# EAGLE design armwiz-board (EAGLE 6.5.0)
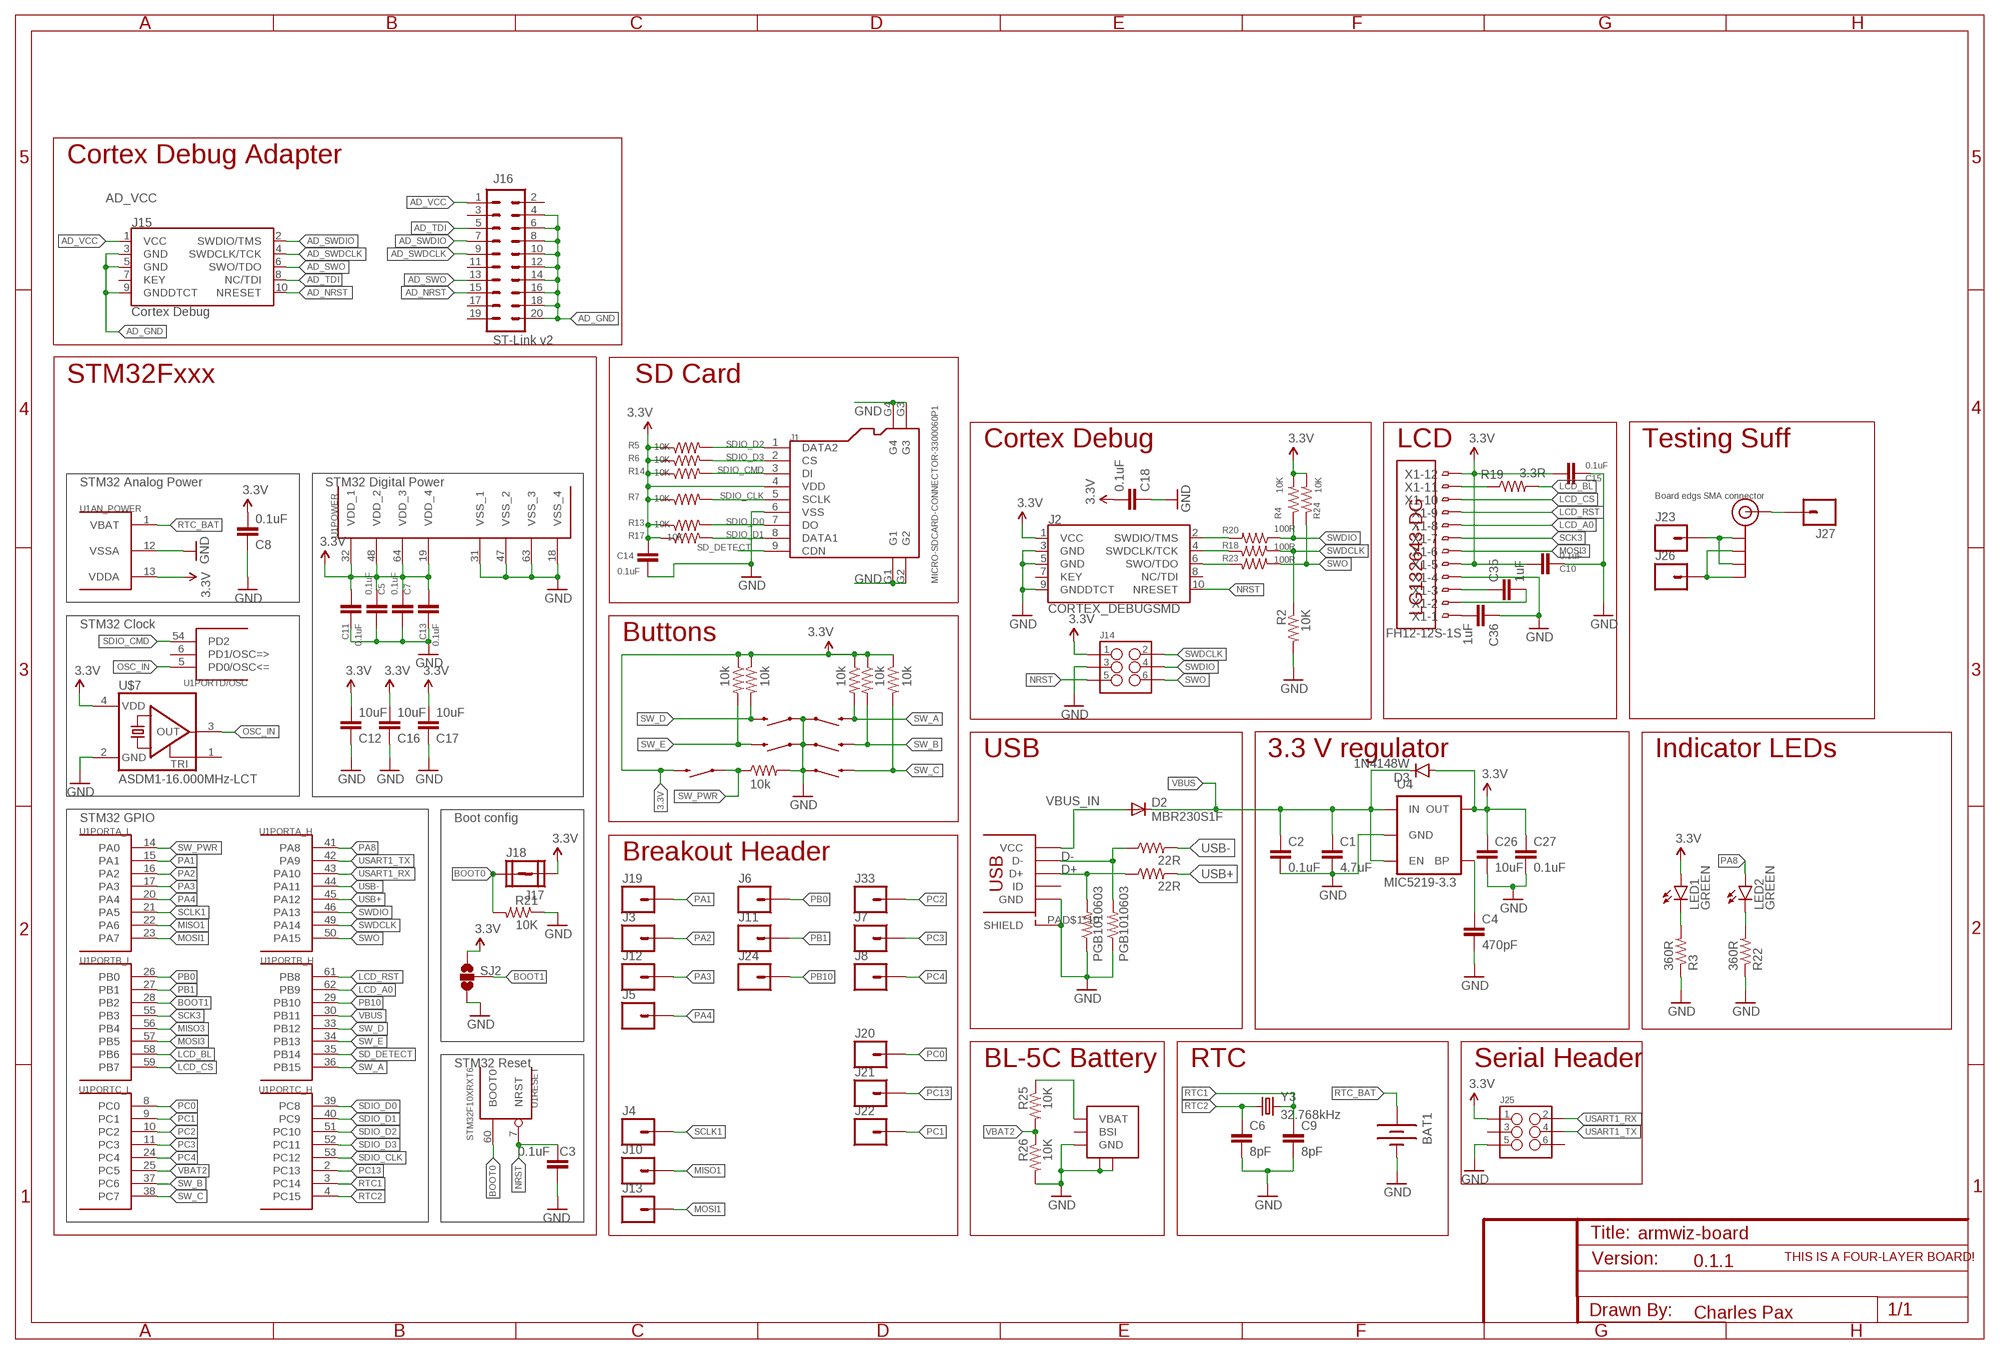
[diagram p0: schematic, sheet 1]

## Parts
BAT1  BATTERY12MM  [BATTCON_12MM]
C1  4.7uF  C-EUC0402K  [C0402K]
C2  0.1uF  C-EUC0402K  [C0402K]
C3  0.1uF  C-EUC0402K  [C0402K]
C4  470pF  C-EUC0402K  [C0402K]
C5  0.1uF  C-EUC0402K  [C0402K]
C6  8pF  C-EUC0402K  [C0402K]
C7  0.1uF  C-EUC0402K  [C0402K]
C8  0.1uF  C-EUC0402K  [C0402K]
C9  8pF  C-EUC0402K  [C0402K]
C10  0.1uF  C-EUC0402K  [C0402K]
C11  0.1uF  C-EUC0402K  [C0402K]
C12  10uF  C-EUC0402K  [C0402K]
C13  0.1uF  C-EUC0402K  [C0402K]
C14  0.1uF  C-EUC0402K  [C0402K]
C15  0.1uF  C-EUC0402K  [C0402K]
C16  10uF  C-EUC0402K  [C0402K]
C17  10uF  C-EUC0402K  [C0402K]
C18  0.1uF  C-EUC0402K  [C0402K]
C26  10uF  C-EUC0402K  [C0402K]
C27  0.1uF  C-EUC0402K  [C0402K]
C35  1uF  C-EUC0402K  [C0402K]
C36  1uF  C-EUC0402K  [C0402K]
D2  MBR230S1F  SPARKFUN-DISCRETESEMI_DIODESOD123SOD123  [SOD123]
D3  1N4148W  DIODESOD123  [SOD-123]
J1  MICRO-SDCARD-CONNECTOR-3300060P1  [9P-SMD-W-RING]
J2  CORTEX_DEBUGSMD  [SAMTECH_FTSH-105-01]
J3  M01PTH  [1X01]
J4  M01PTH  [1X01]
J5  M01PTH  [1X01]
J6  M01PTH  [1X01]
J7  M01PTH  [1X01]
J8  M01PTH  [1X01]
J10  M01PTH  [1X01]
J11  M01PTH  [1X01]
J12  M01PTH  [1X01]
J13  M01PTH  [1X01]
J14  M03X2PAX  [CONNECTORS_2X3_SMT_POSTS_T400]
J15  Cortex Debug  CORTEX_DEBUGSMD  [SAMTECH_FTSH-105-01]
J16  ST-Link v2  M10X2  [2X10]
J17  M01NOSILK-KIT  [1X01NS-KIT]
J18  M01NOSILK-KIT  [1X01NS-KIT]
J19  M01PTH  [1X01]
J20  M01PTH  [1X01]
J21  M01PTH  [1X01]
J22  M01PTH  [1X01]
J23  M01PTH  [1X01]
J24  M01PTH  [1X01]
J25  M03X2PAX  [CONNECTORS_2X3_SMT_POSTS_T400]
J26  M01PTH  [1X01]
J27  M01PTH  [1X01]
J33  M01PTH  [1X01]
J$1  SMA_EDGE  [SMA-EDGE]
LED1  GREEN  LED0603  [LED-0603]
LED2  GREEN  LED0603  [LED-0603]
R1  10k  R-US_R0402  [R0402]
R2  10K  R-US_R0402  [R0402]
R3  360R  R-US_R0402  [R0402]
R4  10K  R-US_R0402  [R0402]
R5  10K  R-US_R0402  [R0402]
R6  10K  R-US_R0402  [R0402]
R7  10K  R-US_R0402  [R0402]
R8  10k  R-US_R0402  [R0402]
R9  22R  R-US_R0402  [R0402]
R10  22R  R-US_R0402  [R0402]
R11  10k  R-US_R0402  [R0402]
R12  10k  R-US_R0402  [R0402]
R13  10K  R-US_R0402  [R0402]
R14  10K  R-US_R0402  [R0402]
R15  10k  R-US_R0402  [R0402]
R16  10k  R-US_R0402  [R0402]
R17  10K  R-US_R0402  [R0402]
R18  100R  R-US_R0402  [R0402]
R19  3.3R  R-US_R0402  [R0402]
R20  100R  R-US_R0402  [R0402]
R21  10K  R-US_R0402  [R0402]
R22  360R  R-US_R0402  [R0402]
R23  100R  R-US_R0402  [R0402]
R24  10K  R-US_R0402  [R0402]
R25  10K  R-US_R0402  [R0402]
R26  10K  R-US_R0402  [R0402]
S1  SWITCH-MOMENTARY-2SMD  [TACTILE_SWITCH_SMD]
S2  SWITCH-MOMENTARY-2SMD  [TACTILE_SWITCH_SMD]
S3  SWITCH-MOMENTARY-2SMD  [TACTILE_SWITCH_SMD]
S4  SWITCH-MOMENTARY-2SMD  [TACTILE_SWITCH_SMD]
S5  SWITCH-MOMENTARY-2SMD  [TACTILE_SWITCH_SMD]
S6  SWITCH-MOMENTARY-2SMD  [TACTILE_SWITCH_SMD]
SJ2  SOLDERJUMPER_2WAYS  [SJ_3]
U1  STM32F10XRXT6  [TQFP64]
U4  MIC5219-3.3V  V_REG_LDOSMD  [SOT23-5]
U$1  USB_MICROSMT+THRUHULE  [USB_MICRO_THRUHOLE]
U$2  FOUR_LAYER_WARNING  [FOUR_LAYER_WARNING]
U$3  BL-5C-CONNECTOR  [BL-5C-CONNECTOR]
U$5  LG132643-DG  [LG132643-DG]
U$7  ASDM1-16.000MHz-LCT  ASE  [ASE]
X1  FH12-12S-1S  [FH12-12S-1SH]
Y3  32.768kHz  CRYSTAL3.2X1.5MM  [CRYSTAL-SMD-3.2X1.5MM]
Z1  PGB1010603  SPARKFUN-RESISTORS_RESISTOR0603-RES  [SPARKFUN-RESISTORS_0603-RES]
Z2  PGB1010603  SPARKFUN-RESISTORS_RESISTOR0603-RES  [SPARKFUN-RESISTORS_0603-RES]

## Nets
3.3V: C5.1 C7.1 C8.2 C10.2 C11.2 C12.2 C13.2 C14.2 C15.2 C16.2 C17.2 C18.2 C26.1 C27.1 D3.A J1.4(VDD) J2.1(VCC) J14.1 J18.1 J25.1 LED1.A R4.2 R5.1 R6.1 R7.1 R8.1 R11.1 R12.1 R13.1 R14.1 R15.1 R16.1 R17.1 R24.2 S6.3 SJ2.3 U1.13(AN_POWER:VDDA) U1.19(POWER:VDD_4) U1.32(POWER:VDD_1) U1.48(POWER:VDD_2) U1.64(POWER:VDD_3) U4.5(OUT) U$7.4(VDD) X1.5 X1.12
AD_GND: J15.3(GND) J15.5(GND) J15.9(GNDDTCT) J16.4 J16.6 J16.8 J16.10 J16.12 J16.14 J16.16 J16.18 J16.20
AD_NRST: J15.10(NRESET) J16.15
AD_SWDCLK: J15.4(SWDCLK/TCK) J16.9
AD_SWDIO: J15.2(SWDIO/TMS) J16.7
AD_SWO: J15.6(SWO/TDO) J16.13
AD_TDI: J15.8(NC/TDI) J16.5
AD_VCC: J15.1(VCC) J16.1
BOOT0: J17.1 R21.2 U1.60(RESET:BOOT0)
BOOT1: SJ2.2 U1.28(PORTB_L:PB2)
D+: R9.1 U$1.PIN$3(D+) Z1.2
D-: R10.1 U$1.PIN$2(D-) Z2.2
GND: BAT1.GND(-) C1.2 C2.2 C3.2 C4.2 C5.2 C6.2 C7.2 C8.1 C9.2 C10.1 C11.1 C12.1 C13.1 C14.1 C15.1 C16.1 C17.1 C18.1 C26.2 C27.2 C36.1 J1.6(VSS) J1.G1 J1.G2 J1.G3 J1.G4 J2.3(GND) J2.5(GND) J2.9(GNDDTCT) J14.3 J25.5 R1.2 R2.2 R3.1 R21.1 R22.1 R26.2 S1.1 S2.1 S3.1 S4.1 S5.1 SJ2.1 U1.12(AN_POWER:VSSA) U1.18(POWER:VSS_4) U1.31(POWER:VSS_1) U1.47(POWER:VSS_2) U1.63(POWER:VSS_3) U4.2(GND) U$1.PAD$1(SHIELD) U$1.PAD$2(SHIELD) U$1.PAD$3(SHIELD) U$1.PAD$4(SHIELD) U$1.PAD$5(SHIELD) U$1.PAD$6(SHIELD) U$1.PAD$7(SHIELD) U$1.PAD$8(SHIELD) U$1.PAD$9(SHIELD) U$1.PAD$10(SHIELD) U$1.PIN$5(GND) U$3.P$3(GND) U$3.P$4 U$3.P$5 U$7.2(GND) X1.4 Z1.1 Z2.1
LCD_A0: U1.62(PORTB_H:PB9) X1.8
LCD_BL: R19.2 U1.58(PORTB_L:PB6)
LCD_CS: U1.59(PORTB_L:PB7) X1.10
LCD_RST: U1.61(PORTB_H:PB8) X1.9
MISO1: J10.1 U1.22(PORTA_L:PA6)
MISO3: U1.56(PORTB_L:PB4)
MOSI1: J13.1 U1.23(PORTA_L:PA7)
MOSI3: U1.57(PORTB_L:PB5) X1.6
N$1: C4.1 U4.4(BP)
N$4: R19.1 X1.11
N$5: J2.4(SWDCLK/TCK) R18.2
N$7: LED1.C R3.2
N$11: LED2.C R22.2
N$12: J2.6(SWO/TDO) R23.2
N$13: J2.2(SWDIO/TMS) R20.2
N$14: J26.1 J$1.GND@1(GND) J$1.GND@3(GND)
N$15: J23.1 J$1.GND@0(GND) J$1.GND@2(GND)
N$16: R25.1 U$3.P$1(VBAT)
N$20: J27.1 J$1.SIG(SIGNAL)
N$37: C35.1 X1.3
N$38: C35.2 X1.2
N$39: C36.2 X1.1
NRST: C3.1 J2.10(NRESET) J14.5 U1.7(RESET:NRST)
OSC_IN: U1.5(PORTD/OSC:PD0/OSC<=) U$7.3(OUT)
PA1: J19.1 U1.15(PORTA_L:PA1)
PA2: J3.1 U1.16(PORTA_L:PA2)
PA3: J12.1 U1.17(PORTA_L:PA3)
PA4: J5.1 U1.20(PORTA_L:PA4)
PA8: LED2.A U1.41(PORTA_H:PA8)
PB0: J6.1 U1.26(PORTB_L:PB0)
PB1: J11.1 U1.27(PORTB_L:PB1)
PB10: J24.1 U1.29(PORTB_H:PB10)
PC0: J20.1 U1.8(PORTC_L:PC0)
PC1: J22.1 U1.9(PORTC_L:PC1)
PC2: J33.1 U1.10(PORTC_L:PC2)
PC3: J7.1 U1.11(PORTC_L:PC3)
PC4: J8.1 U1.24(PORTC_L:PC4)
PC13: J21.1 U1.2(PORTC_H:PC13)
RTC1: C9.1 U1.3(PORTC_H:PC14) Y3.P$2
RTC2: C6.1 U1.4(PORTC_H:PC15) Y3.P$1
RTC_BAT [RTC battery]: BAT1.PWR@1(+) U1.1(AN_POWER:VBAT)
SCK3: U1.55(PORTB_L:PB3) X1.7
SCLK1: J4.1 U1.21(PORTA_L:PA5)
SD_DETECT: J1.9(CDN) U1.35(PORTB_H:PB14)
SDIO_CLK: J1.5(SCLK) R7.2 U1.53(PORTC_H:PC12)
SDIO_CMD: J1.3(DI) R14.2 U1.54(PORTD/OSC:PD2)
SDIO_D0: J1.7(DO) R13.2 U1.39(PORTC_H:PC8)
SDIO_D1: J1.8(DATA1) R17.2 U1.40(PORTC_H:PC9)
SDIO_D2: J1.1(DATA2) R5.2 U1.51(PORTC_H:PC10)
SDIO_D3: J1.2(CS) R6.2 U1.52(PORTC_H:PC11)
SW_A: R8.2 S3.3 U1.36(PORTB_H:PB15)
SW_B: R11.2 S2.3 U1.37(PORTC_L:PC6)
SW_C: R12.2 S1.3 U1.38(PORTC_L:PC7)
SW_D: R15.2 S4.3 U1.33(PORTB_H:PB12)
SW_E: R16.2 S5.3 U1.34(PORTB_H:PB13)
SW_PWR: R1.1 S6.1 U1.14(PORTA_L:PA0)
SWDCLK: J14.2 R2.1 R18.1 U1.49(PORTA_H:PA14)
SWDIO: J14.4 R4.1 R20.1 U1.46(PORTA_H:PA13)
SWO: J14.6 R23.1 R24.1 U1.50(PORTA_H:PA15)
USART1_RX: J25.2 U1.43(PORTA_H:PA10)
USART1_TX: J25.4 U1.42(PORTA_H:PA9)
USB+: R9.2 U1.45(PORTA_H:PA12)
USB-: R10.2 U1.44(PORTA_H:PA11)
VBAT2: R25.2 R26.1 U1.25(PORTC_L:PC5)
VBUS [3.3V power]: C1.1 C2.1 D2.C D3.C U1.30(PORTB_H:PB11) U4.1(IN) U4.3(EN)
VBUS_IN [3.3V power]: D2.A U$1.PIN$1(VCC)
Unconnected: J2.7(KEY) J2.8(NC/TDI) J15.7(KEY) J16.2 J16.3 J16.11 J16.17 J16.19 J25.3 J25.6 U1.6(PORTD/OSC:PD1/OSC=>) U$1.PIN$4(ID) U$3.P$2(BSI) U$7.1(TRI)

## Notes on the sheet
- Cortex Debug Adapter
- STM32Fxxx | SD Card
- Cortex Debug | LCD | Testing Suff
- STM32 Analog Power | STM32 Digital Power
- Board edgs SMA connector
- STM32 Clock
- Buttons
- USB | 3.3 V regulator | Indicator LEDs
- STM32 GPIO | Boot config
- Breakout Header
- MIC5219-3.3
- STM32 Reset | BL-5C Battery | RTC | Serial Header
- 0.1.1
- Charles Pax

## Library data of the parts
BAT1 = PaxInstruments-Electromechanical:BATTERY: Battery Holders Various common sizes : AA, AAA, 20mm coin cell and 12mm coin cell. 20MM_4LEGS, BATT-10373; MF: Keystone Electronics; MPN: 3000TR
C1-C18 C26 C27 C35 C36 = resistor:C-EU: CAPACITOR, European symbol
D2 = PaxInstrument-T400:SPARKFUN-DISCRETESEMI_DIODE: Diode These are standard reverse protection diodes and small signal diodes. SMA package can handle up to about 1A. SOD-323 can handle about 200mA. What the SOD-323 package when ordering, there are some mfgs out there that are 5-pin packages.; MF: DIODES INC; MPN: MBR230S1F-7
D3 = SparkFun-DiscreteSemi:DIODE: Diode These are standard reverse protection diodes and small signal diodes. SMA package can handle up to about 1A. SOD-323 can handle about 200mA. What the SOD-323 package when ordering, there are some mfgs out there that are 5-pin packages.
J1 = PaxInstrument-T400:MICRO-SDCARD-CONNECTOR: Micro SD Card; MF: SUNTECH; MPN: ST-TF-003A
J2 J15 = SparkFun-Connectors:CORTEX_DEBUG: Cortex Debug Connector Datasheet <http://infocenter.arm.com/help/topic/com.arm.doc.faqs/attached/13634/cortex_debug_connectors.pdf>
J3-J8 J10-J13 J17-J24 J26 J27 J33 = SparkFun-Connectors:M01: Header 1 Standard 1-pin 0.1" header. Use with straight break away headers (SKU : PRT-00116), right angle break away headers (PRT-00553), swiss pins (PRT-00743), machine pins (PRT-00117), and female headers (PRT-00115). SMTSO-256-ET is a "flush mount" nut for a 4-40 screw. The older package used to be too tight, and did not allow it to sit properly thru the drill hit. The latest (0.165DIA) fits nice and snug.
J14 J25 = PaxInstruments-Connectors:M03X2: 2x3 .1" header. Shrouded, with keying- CONN-10681 SMT- CONN-11415 Pogo pins- HW-11044; MF: FCI; MPN: 95278-101A06LF
J16 = SparkFun-Connectors:M10X2: This was SPECIALLY designed to be used with our Graphic LCD Backpack. Be sure you want to use this! It is not only staggered on each line of header holes, but IT IS ALSO offset of the center point of the top and bottom lines by 5 mil. This causes the headers to lock into place on the "standard" footprint on the LCD screen. The extra squares on the tdocu layer are there simply to reference other pins (if you were to actually populate a longer header than ten long - this is what we do with the backpacks).
J$1 = SparkFun-Connectors:SMA_EDGE: SMA Antenna Connector End launch SMA connector. The paste layer has been removed so that the connector can be hand soldered onto the board after reflow.
LED1 LED2 = SparkFun-LED:LED: LEDs Standard schematic elements and footprints for 5mm, 3mm, 1206, and 0603 sized LEDs. 5mm - Spark Fun Electronics SKU : COM-00529 (and others)
R1 R8 R11 R12 R15 R16 = resistor:R-US_: RESISTOR, American symbol; POPULATE: DNP
R2-R7 R9 R10 R13 R14 R17-R26 = resistor:R-US_: RESISTOR, American symbol
S1-S6 = SparkFun-Electromechanical:SWITCH-MOMENTARY-2: Various NO switches- pushbuttons, reed, etc; MF: C&K Components; MPN: RS-187R05A2-DS MT RT
SJ2 = SparkFun-Retired:SOLDERJUMPER_2WAY: Solder Jumper 2 way solder jumper
U1 = stm32:STM32F10XRXT6: STM32F101/103 64pin LQFP
U4 = SparkFun:V_REG_LDO: Voltage Regulator LDO Standard 150mA LDO voltage regulator in SOT-23 layout. Micrel part MIC5205. BP (by-pass) pin is used to lower output noise with 470pF cap.; MF: Micrel; MPN: MIC5219-3.3YM5 TR
U$1 = blinkinlabs:USB_MICRO; MF: FCI; MPN: 10118194-0001LF
U$2 = SparkFun-Aesthetics:FOUR_LAYER_WARNING: Warning text which will appear on both the schematic and the board file, notifying viewers that the design is a four-layer PCB.
U$3 = PaxInstruments-Connectors:BL-5C-CONNECTOR; MPN: BC-4-3P (77H)
U$5 = charlespax:LG132643-DG; MPN: LG132643-DW
U$7 = crystal:ASE: 3.3Vdc CMOS SMD CRYSTAL CLOCK OSCILLATOR SOurce: www.abracon.com; OC_FARNELL: unknown; OC_NEWARK: unknown
X1 = PaxInstrument-T400:FH12-12S-1S; MF: Hirose Connector; MPN: FH12-12S-1SH(55)
Y3 = SparkFun-FreqCtrl:CRYSTAL: Various standard crystals. Proven footprints.; PROD_ID: XTAL-13062
Z1 Z2 = PaxInstrument-T400:SPARKFUN-RESISTORS_RESISTOR: Resistor Basic schematic elements and footprints for 0603, 1206, and PTH resistors.; MF: Littelfuse; MPN: PGB1010603NRHF

## Net classes
0 Digital signal: width 0.075 mm, drill 0.2 mm, clearance 0.075 mm
1 3.3V power: width 0.075 mm, drill 0.2 mm, clearance 0.075 mm
2 RTC battery: width 0.075 mm, drill 0.2 mm, clearance 0.075 mm
3 5V power: width 0.075 mm, drill 0.2 mm, clearance 0.075 mm
4 Analog signal: width 0.075 mm, drill 0.2 mm, clearance 0.075 mm
5 Ground: width 0.075 mm, drill 0.2 mm, clearance 0.075 mm

## Board
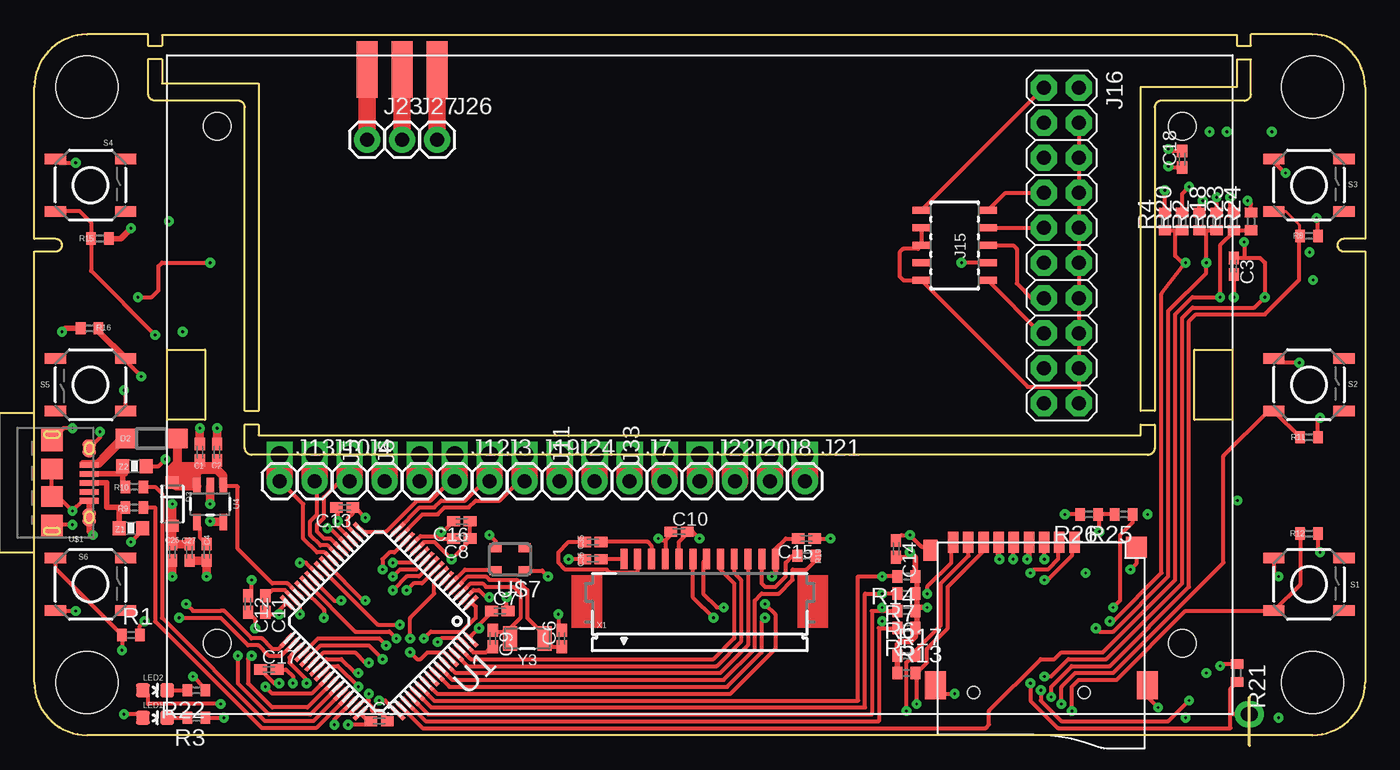
[diagram p1: board, top side]
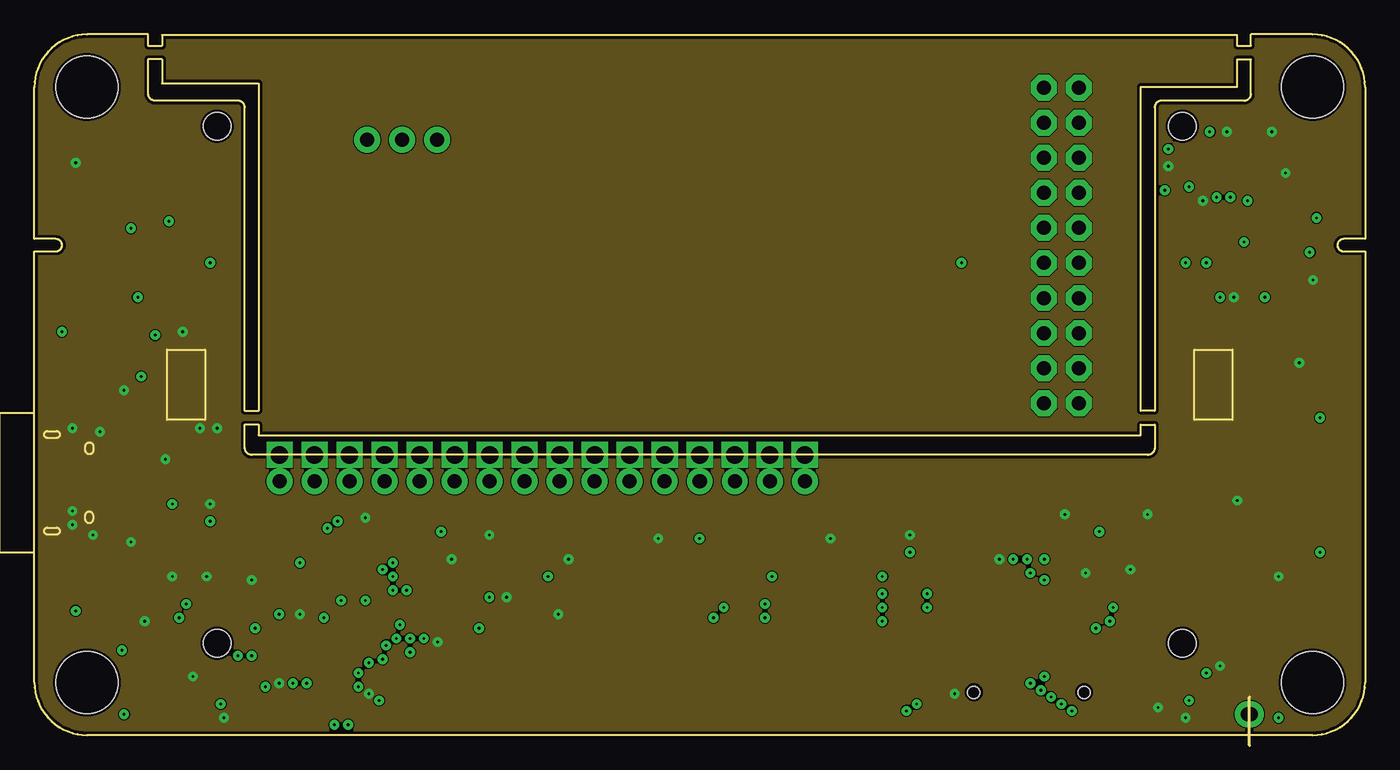
[diagram p2: board, inner layer GND]
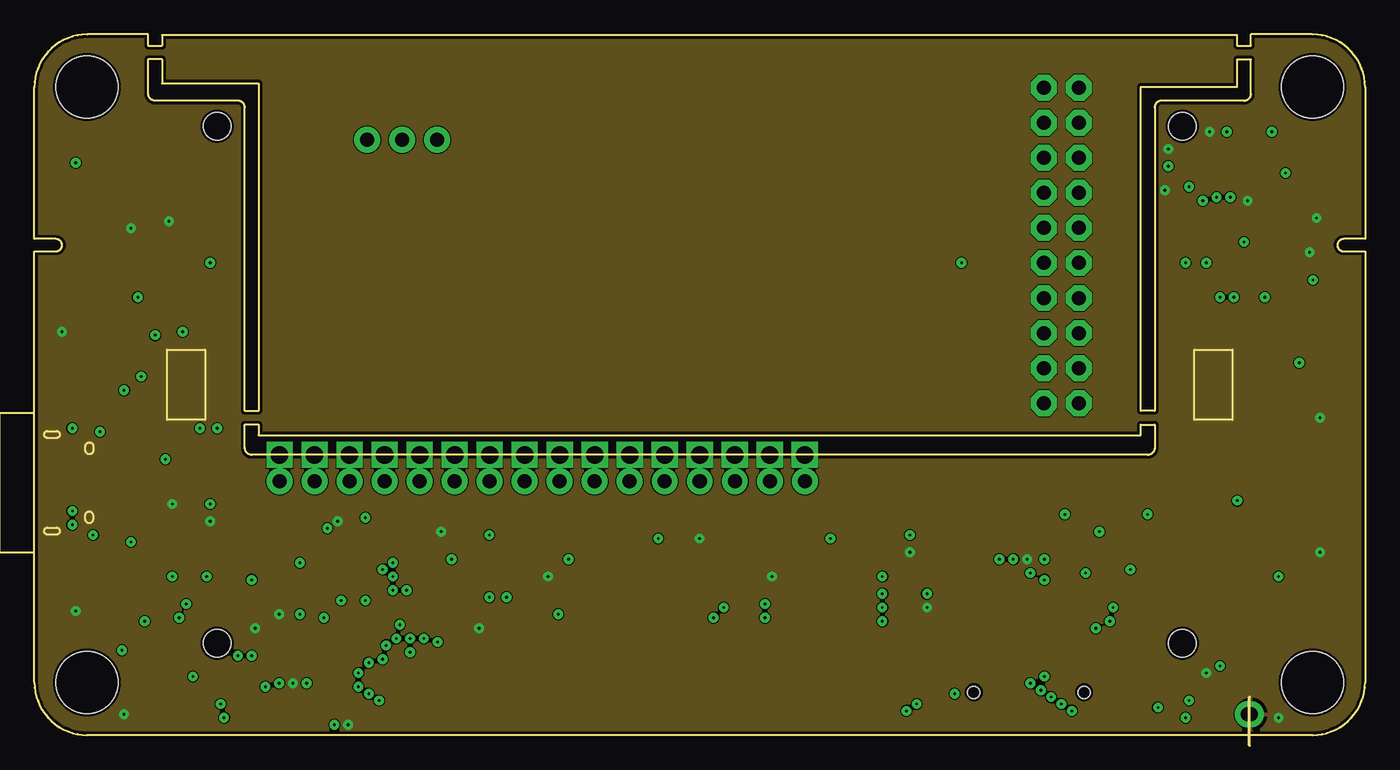
[diagram p3: board, inner layer 3.3V]
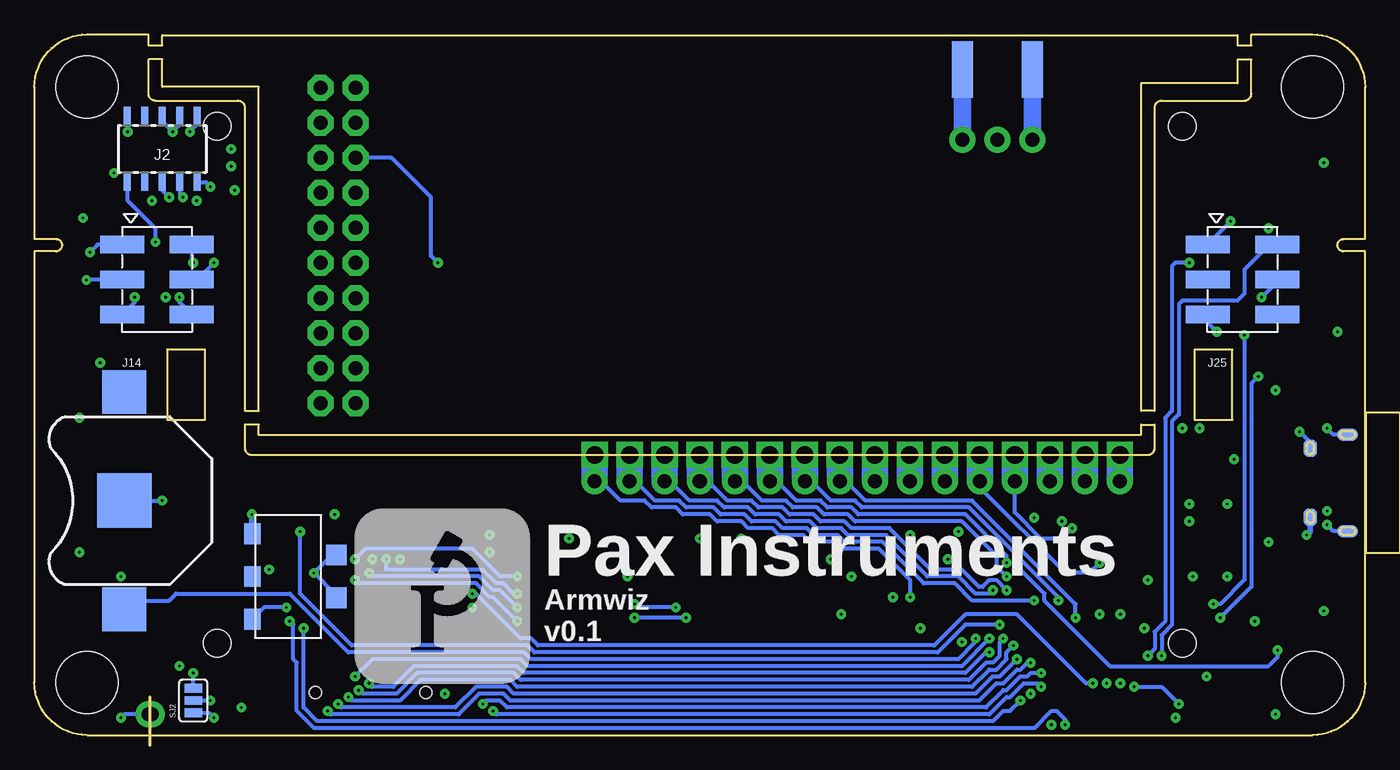
[diagram p4: board, bottom side, seen from below]

Size 96.52 x 50.8 mm. Coordinates in mm from the lower left corner, seen from the top.
Outline: 92.71,0 3.81,0 arc-90 0,3.81 0,35.07 1.55,35.07 arc90 2,35.52 arc90 1.55,35.97 0,35.97 0,46.99 arc-90 3.81,50.8 8.25,50.8 8.25,50 9.25,50 9.25,50.75 87.25,50.75 87.25,50 88.25,50 88.25,50.8 92.71,50.8 arc-90 96.52,46.99 96.52,35.97 94.97,35.97 arc90 94.52,35.52 arc90 94.97,35.07 96.52,35.07 96.52,3.81 arc-90 92.71,0
Outline: 81.26,45.5 81.26,23.5 80.25,23.5 80.25,47 87.25,47 87.25,49 88.25,49 88.25,46.5 arc-90 87.75,46 81.76,46 arc90 81.26,45.5
Outline: 81.26,22.5 81.26,20.82 arc-90 80.76,20.32 15.76,20.32 arc-90 15.26,20.82 15.26,22.5 16.25,22.5 16.25,21.75 80.25,21.75 80.25,22.5 81.26,22.5
Outline: 15.26,23.5 15.26,45.5 arc90 14.76,46 8.75,46 arc-90 8.25,46.5 8.25,49 9.25,49 9.25,47.25 16.25,47.25 16.25,23.5 15.26,23.5
Copper layers (1*2+15*16): Top 0.017mm / dielectric 0.5mm / GND 0.017mm / dielectric 0.075mm / 3.3V 0.017mm / dielectric 0.5mm / Bottom 0.017mm
Design rules "PaxInstrument-T400 *": minimum track width 0.1mm, minimum drill 0.2mm, track to track 0.075mm, track to pad 0.075mm, pad to pad 0.075mm, via to via 0.075mm, smd to smd 0.075mm, copper to edge 0.2mm, drill to drill 0.2mm, minimum pad ring 12mil, minimum via ring 10mil, stop-mask expansion 0.05mm, vias tented up to drill 0.2mm, thermal gap 10mil
Holes 4.5 mm at 92.71,3.81 92.71,46.99 3.81,46.99 3.81,3.81
tKeepout: area 0.3,0.3 to 7.3,7.3; area 0.3,43.5 to 7.3,50.5; area 89.2,43.5 to 96.2,50.5; area 89.2,0.3 to 96.2,7.3
vRestrict: area 15.2,1.3 to 81.3,52.1
Milling: 5 lines

### Footprints (pad centres in the part's own frame; a part is rotated, then mirrored left to right if it is on the bottom)
BATTCON_12MM = smd 3.962 x 3.962: GND 0,0 | smd 3.175 x 3.175: PWR@1 -7.874,0; PWR@2 7.874,0
C0402K = smd 0.925 x 0.74: 1 -0.6,0; 2 0.6,0
SOD123 = smd 1.4 x 1.4: A 1.9,0; C -1.9,0
SOD-123 = smd 0.9 x 0.95: A 1.575,0; C -1.575,0
9P-SMD-W-RING = smd 1.524 x 0.762: 1 -7.493,2.414; 2 -7.493,1.314; 3 -7.493,0.214; 4 -7.493,-0.886; 5 -7.493,-1.986; 6 -7.493,-3.086; 7 -7.493,-4.186; 8 -7.493,-5.286; 9 -7.493,-6.386 | smd 1.524 x 1.016: G1 -6.893,-8.032 | smd 2.032 x 1.524: G2 2.88,-7.686; G3 2.88,7.714 | smd 1.524 x 1.524: G4 -7.101,6.895 | hole 0.889: 3.407,-4.886; 3.407,3.114
SAMTECH_FTSH-105-01 = smd 0.508 x 1.27: 1 -2.54,-2.413; 2 -2.54,2.413; 3 -1.27,-2.413; 4 -1.27,2.413; 5 0,-2.413; 6 0,2.413; 7 1.27,-2.413; 8 1.27,2.413; 9 2.54,-2.413; 10 2.54,2.413
1X01 = drill 1.016 pad 1.88: 1 0,0
CONNECTORS_2X3_SMT_POSTS_T400 = smd 1.27 x 3.2: 1 -2.54,-2.52; 2 -2.54,2.52; 3 0,-2.52; 4 0,2.52; 5 2.54,-2.52; 6 2.54,2.52
2X10 = drill 1.016 pad 1.88 octagon: 1 -11.43,-1.27; 2 -11.43,1.27; 3 -8.89,-1.27; 4 -8.89,1.27; 5 -6.35,-1.27; 6 -6.35,1.27; 7 -3.81,-1.27; 8 -3.81,1.27; 9 -1.27,-1.27; 10 -1.27,1.27; 11 1.27,-1.27; 12 1.27,1.27; 13 3.81,-1.27; 14 3.81,1.27; 15 6.35,-1.27; 16 6.35,1.27; 17 8.89,-1.27; 18 8.89,1.27; 19 11.43,-1.27; 20 11.43,1.27
1X01NS-KIT = drill 1.016 pad 1.88: 1 0,0
SMA-EDGE = smd 1.524 x 4.064: GND@0 0,0; GND@1 5.08,0; SIG 2.54,0 | smd 1.524 x 4.064 bottom: GND@2 0,0; GND@3 5.08,0
LED-0603 = smd 1 x 1: A 0,-0.877; C 0,0.877
R0402 = smd 0.7 x 0.9: 1 -0.65,0; 2 0.65,0
TACTILE_SWITCH_SMD = smd 1.524 x 0.762: 1 -2.54,1.905; 2 2.54,1.905; 3 -2.54,-1.905; 4 2.54,-1.905
SJ_3 = smd 0.635 x 1.27: 1 -0.889,0; 2 0,0; 3 0.889,0
TQFP64 = smd 1.2 x 0.3: 1 -5.7,3.75; 2 -5.7,3.25; 3 -5.7,2.75; 4 -5.7,2.25; 5 -5.7,1.75; 6 -5.7,1.25; 7 -5.7,0.75; 8 -5.7,0.25; 9 -5.7,-0.25; 10 -5.7,-0.75; 11 -5.7,-1.25; 12 -5.7,-1.75; 13 -5.7,-2.25; 14 -5.7,-2.75; 15 -5.7,-3.25; 16 -5.7,-3.75; 33 5.7,-3.75; 34 5.7,-3.25; 35 5.7,-2.75; 36 5.7,-2.25; 37 5.7,-1.75; 38 5.7,-1.25; 39 5.7,-0.75; 40 5.7,-0.25; 41 5.7,0.25; 42 5.7,0.75; 43 5.7,1.25; 44 5.7,1.75; 45 5.7,2.25; 46 5.7,2.75; 47 5.7,3.25; 48 5.7,3.75 | smd 0.3 x 1.2: 17 -3.75,-5.7; 18 -3.25,-5.7; 19 -2.75,-5.7; 20 -2.25,-5.7; 21 -1.75,-5.7; 22 -1.25,-5.7; 23 -0.75,-5.7; 24 -0.25,-5.7; 25 0.25,-5.7; 26 0.75,-5.7; 27 1.25,-5.7; 28 1.75,-5.7; 29 2.25,-5.7; 30 2.75,-5.7; 31 3.25,-5.7; 32 3.75,-5.7; 49 3.75,5.7; 50 3.25,5.7; 51 2.75,5.7; 52 2.25,5.7; 53 1.75,5.7; 54 1.25,5.7; 55 0.75,5.7; 56 0.25,5.7; 57 -0.25,5.7; 58 -0.75,5.7; 59 -1.25,5.7; 60 -1.75,5.7; 61 -2.25,5.7; 62 -2.75,5.7; 63 -3.25,5.7; 64 -3.75,5.7
SOT23-5 = smd 0.55 x 1.2: 1 -0.95,-1.3; 2 0,-1.3; 3 0.95,-1.3; 4 0.95,1.3; 5 -0.95,1.3
USB_MICRO_THRUHOLE = smd 1.645 x 1.55: PAD$1 -3.123,0; PAD$4 3.123,0 | smd 1.5 x 1.55: PAD$2 -1,0; PAD$3 1,0 | smd 1.25 x 0.95: PAD$5 -2.5,2.7; PAD$6 2.5,2.7 | smd 0.9 x 1.55 bottom: PAD$7 -3.5,0; PAD$8 3.5,0 | smd 1.25 x 0.95 bottom: PAD$9 -2.5,2.7; PAD$10 2.5,2.7 | smd 0.4 x 1.35: PIN$1 -1.3,2.7; PIN$2 -0.65,2.7; PIN$3 0,2.7; PIN$4 0.65,2.7; PIN$5 1.3,2.7
BL-5C-CONNECTOR = smd 1.5 x 1.2: P$1 3.1,-0.2; P$2 0,-0.2; P$3 -3.1,-0.2 | smd 1.5 x 1.5: P$4 1.55,5.9; P$5 -1.55,5.9
LG132643-DG = hole 2: -35,-18.75; 35,-18.75; 35,18.75; -35,18.75
ASE = smd 0.9 x 0.65: 1 -1.05,-0.825; 2 1.05,-0.825; 3 1.05,0.825; 4 -1.05,0.825
FH12-12S-1SH = smd 0.5 x 1.5: 1 -5.5,2.297; 2 -4.5,2.297; 3 -3.5,2.297; 4 -2.5,2.297; 5 -1.5,2.297; 6 -0.5,2.297; 7 0.5,2.297; 8 1.5,2.297; 9 2.5,2.297; 10 3.5,2.297; 11 4.5,2.297; 12 5.5,2.297
CRYSTAL-SMD-3.2X1.5MM = smd 1 x 1.8: P$1 -1.25,0; P$2 1.25,0
SPARKFUN-RESISTORS_0603-RES = smd 0.94 x 1.016: 1 -0.85,0; 2 0.85,0

### Placement (x,y rotation side)
BAT1  90,17 90 bottom
C1  12,20.5 90 top
C2  13.25,20.5 90 top
C3  87,34 270 top
C4  12.5,13.25 270 top
C5  25,1 0 top
C6  38.25,7 90 top
C7  33.75,9 0 top
C8  31,14.25 180 top
C9  33.25,7 270 top
C10  46.75,14.75 0 top
C11  16.75,9.5 270 top
C12  15.5,9.5 270 top
C13  22.5,16.5 180 top
C14  62.5,13.5 270 top
C15  56,14.25 180 top
C16  31,15.5 180 top
C17  17,4.75 0 top
C18  83.25,41.75 90 top
C26  10,13.25 270 top
C27  11.25,13.25 270 top
C35  40.5,14 180 top
C36  40.5,12.75 0 top
D2  8.5,21.5 180 top
D3  10,16.75 270 top
J1  73.03,6.5 270 top
J2  87.25,42.5 180 bottom
J3  33.02,18.41 0 top
J4  22.86,18.41 0 top
J5  25.4,18.41 90 top
J6  27.94,18.41 90 top
J7  43.18,18.41 0 top
J8  53.34,18.41 0 top
J10  20.32,18.41 0 top
J11  40.64,18.41 90 top
J12  30.48,18.41 0 top
J13  17.78,18.41 0 top
J14  87.63,33.02 270 bottom
J15  66.75,35.5 270 top
J16  74.5,35.5 270 top
J17  88,1.5 90 top
J18  88.25,1.5 90 top
J19  35.56,18.41 0 top
J20  50.8,18.41 0 top
J21  55.88,18.41 0 top
J22  48.26,18.41 0 top
J23  24.13,43.18 0 top
J24  38.1,18.41 0 top
J25  8.89,33.02 270 bottom
J26  29.21,43.18 0 top
J27  26.67,43.18 0 top
J33  45.72,18.41 90 top
J$1  24.13,48.26 0 top
LED1  8.75,1.25 270 top
LED2  8.75,3.25 270 top
R1  7,7.25 0 top
R2  84.5,37.25 90 top
R3  11.75,1.25 180 top
R4  82,37.25 90 top
R5  63.25,7.75 180 top
R6  63.25,9 180 top
R7  63.25,10.25 180 top
R8  92.46,36.2 180 top
R9  7.25,16.5 0 top
R10  7.25,18 0 top
R11  92.46,21.59 180 top
R12  92.46,14.61 180 top
R13  63.25,4.5 0 top
R14  63.25,11.5 180 top
R15  4.75,36 180 top
R16  4,29.5 0 top
R17  63.25,5.75 0 top
R18  85.75,37.25 90 top
R19  56,13 0 top
R20  83.25,37.25 90 top
R21  87.25,4.5 270 top
R22  11.75,3.25 180 top
R23  87,37.25 90 top
R24  88.25,37.25 90 top
R25  79,16 180 top
R26  76.5,16 180 top
S1  92.46,10.92 0 top
S2  92.46,25.4 0 top
S3  92.46,39.88 0 top
S4  4.06,39.88 0 top
S5  4.06,25.4 180 top
S6  4.06,10.92 0 top
SJ2  85,2.5 90 bottom
U1  25,8.25 225 top
U4  12.75,16.75 180 top
U$1  1.27,18.29 270 top
U$2  0.64,-3.81 0 top  (outside the outline)
U$3  80.52,11.5 270 bottom
U$5  48.26,25.4 0 bottom
U$6  [PAX-LOGO-0.5IN]  73.28,3.73 0 bottom
U$7  34.5,12.75 180 top
X1  48.26,10.48 0 top
Y3  35.75,7 180 top
Z1  7,15 180 top
Z2  7.25,19.5 180 top

### Tracks (layer width: path | path; a pad name or v marks a point on that pad's centre or on a via)
3.3V  (via drill 0.2)
  Top 0.305: R8.1 93.11,37.39 v93,37.5 | R11.1 93.11,22.86 v93.25,23 | R12.1 93.11,13.39 v93.25,13.25 | X1.5 46.75,12.79 46.75,14 47.35,14.6 C10.2 47.75,14.75 v48.25,14.25 | U1.32 17.75,9.06 v17.75,8.75 16.9,8.75 C11.2 | S6.3 2.98,9.02 v3,9 | 62.85,12.75 62.5,12.75 C14.2 63.15,12.9 v63.5,13.25 | U1.19 22,15.14 v22,15.5 22,16.1 21.9,16.2 C13.2 | U1.64 31.68,7.18 v32.25,7.75 32.25,8 33.15,8.9 C7.1 | X1.12 53.75,12.79 53.75,13.5 54.5,14.25 C15.2 | U1.13 27.99,14.42 29.32,14.42 | 29.32,14.42 29.33,14.42 | v29.5,14.75 29.5,14.42 29.33,14.42 | R4.2 v82,39.5 | R24.2 88.25,38.5 v88,38.75 | C18.2 82.4,42.35 v82.25,42.5 | LED1.A 7.62,1.5 v6.5,1.5 | U$7.4 36.83,11.93 v37.25,11.5 | v22.75,0.75 24.15,0.75 C5.1 24.19,1 U1.48 | C12.2 16,8.4 v16,7.75 | 29.33,14.42 29.5,14.25 C8.2 | C17.2 18.25,4.75 18.75,4.25 v18.75,3.75 | C16.2 29.32,14.42
  Top 0.406: J1.4 72.14,12.89 v72,12.75 | X1.12 53.76,11.76 v53.5,11.5 | R15.1 6.25,36 v7,36.75 | R16.1 2.25,29.5 v2,29.25 | R13.1 R17.1 62.6,6.6 62.75,6.75 63.5,6.75 63.9,7.15 R5.1 | 63.75,7.6 R5.1 | v63.5,13.25 63.9,12.85 R14.1 64,11.4 64,10.15 | 64.5,9.25 v64.75,9.25 64.15,9.25 R6.1 | 64,10.15 R7.1 | 64,10.15 64,7.75 R5.1
  Top 0.61: v10,16.75 D3.A C26.1 C27.1 | U4.5 12.8,15.45 v12.75,15.5
  Bottom 0.305: J18.1 90,1.5 v90.25,1.25 | SJ2.3 v85,4.5 | J2.1 84.71,44.29 v85.25,43.75 | J14.1 91.94,35.56 v92.5,35 | J25.1 11.41,35.59 v9.75,37.25
  pour 3.3V: 96.52,50.8 96.52,0 0,0 0,50.8
AD_GND
  Top 0.305: J15.3 J15.5 64.09,35.25 63,35.25 62.75,35 62.75,33.25 63.04,32.96 J15.9 72.05,25.25 75.77,25.25 | J16.4 J16.6 J16.8 J16.10 J16.12 J16.14 J16.16 J16.18 75.77,25.25 | 75.77,25.25 J16.20
AD_NRST
  Top 0.305: J15.10 72.97,29.15 J16.15
AD_SWDCLK
  Top 0.305: J15.4 J16.9
AD_SWDIO
  Top 0.305: J15.2 70.43,39.31 J16.7
AD_SWO
  Top 0.305: J15.6 71,35.5 71.25,35.25 71.25,32.75 72.31,31.69 J16.13
AD_TDI  (via drill 0.2)
  Top 0.305: J15.8 69.14,34.25 v67.25,34.25
  Bottom 0.305: v67.25,34.25 67.75,34.75 67.75,39 70.6,41.85 J16.5
AD_VCC
  Top 0.305: J15.1 J16.1
BOOT0  (via drill 0.2)
  Top 0.305: U1.60 29.73,6 28.5,6 28,5.5 27.75,5.5 v27.25,6 | v72.25,3.75 72.25,2.5 74.25,0.5 86.75,0.5 86.75,1.5 | 86.75,1.5 86.75,3.35 R21.2 | J17.1 86.75,1.5
  Bottom 0.305: v72.25,3.75 72,3.5 70.5,3.5 69,5 61.5,5 61,4.5 29,4.5 27.5,6 v27.25,6
BOOT1  (via drill 0.2)
  Top 0.305: v73,3.25 73,2.5 74.5,1 82.25,1 v83.75,2.5 | U1.28 23.27,7.5 25.75,7.5 v26.25,7
  Bottom 0.305: v73,3.25 72.75,3 70.25,3 68.75,4.5 61.75,4.5 61.25,4 28.75,4 27.5,5.25 27,5.25 26.5,5.75 26.5,6.75 v26.25,7 | v83.75,2.5 SJ2.2
D+
  Top 0.4: U$1.PIN$3 5.25,18.29 5.25,16.5 6,16.5 R9.1 6.65,16.5
  Top 0.406: Z1.2 6.15,16.35 6,16.5
D-
  Top 0.4: R10.1 6.4,18 6.4,19 Z2.2
  Top 0.406: U$1.PIN$2 6.59,18.94 6.4,19
GND  (via drill 0.2)
  Top 0.305: S3.1 89.92,41.58 v90.75,40.75 | S1.1 89.92,11.83 v90.25,11.5 | Z1.1 7.85,14.85 v7,14 | U$1.PIN$5 3.49,16.99 v2.75,16.25 1.71,17.29 U$1.PAD$3 U$1.PAD$2 | v2.75,15.25 1.35,15.25 U$1.PAD$4 | v4.75,22 4.75,21.57 U$1.PAD$9 | v2.75,22.25 2.11,22.25 U$1.PAD$1 | S5.1 6.6,24.85 v6.5,25 | Z2.1 9,19.5 v9.5,20 | 45.76,14.11 X1.4 | S4.1 1.81,41.5 v3,41.5 | v19.25,8.75 19.25,9.4 U1.31 18.15,10.5 17.25,10.5 16.85,10.1 C11.1 | C14.1 62.9,14.5 v63.5,14.5 64.31,13.69 J1.G1 | v45.25,14.25 45.39,14.11 45.76,14.11 | v29.25,6.75 29.5,7 30.85,7 U1.63 31.85,6 32.75,6 33.15,6.4 C9.2 | U1.12 28.27,14 29,14 v30.25,12.75 31.5,14 31.5,14.15 C8.1 C16.1 | U1.18 22.75,15.1 22.75,15.75 23.1,16.1 C13.1 23.25,16.5 v24,15.75 | J1.G3 80.61,3.75 80.61,2.89 v81.5,2 | v91.75,27 90.22,27 S2.1 | C36.1 v38.75,12.75 | C15.1 v57.75,14.25 | 45.76,14.11 46.15,14.5 C10.1 | R1.2 7.65,7.9 v8,8.25 | R3.1 v13.75,1.25 | R22.1 12.4,3.35 v11.5,4.25 | R21.1 86.15,5.15 v86,5 | R2.2 84.5,38.5 v84.75,38.75 | C18.1 82.35,41.15 v82.25,41.25 | C3.2 v87,31.75 | J1.G2 65.96,3 v66.75,3 | U$7.2 33.45,14.05 v33,14.5 | v38,8.75 38,7.85 C6.2 | C7.2 34.25,9.1 v34.25,10 | C5.2 25.6,1.15 25,1.75 24.5,1.75 24.5,2 24.25,2.25 24.25,2.5 | 24.25,2.5 v24.25,3 | U1.47 23.85,2.5 24.25,2.5 | C12.1 15.75,10.35 v15.75,11.25 | C17.1 17.4,3.75 v17.75,3.75 | R26.2 v74.75,16 | J1.G4 79.92,12.42 v79.5,12
  Top 0.406: J1.6 69.94,12.81 v70,12.75 | J1.G1 64.69,13.69 | v4.25,14.5 3.96,14.79 U$1.PAD$10 U$1.PIN$5
  Top 0.61: U4.2 v12.75,16.75 | C1.2 v12,22.25 | C2.2 v13.25,22.25 | v12.5,11.5 C4.2 C27.2 | v10,11.5 C26.2
  Bottom 0.305: U$1.PAD$8 2.29,14.79 v2.75,15.25 | U$1.PAD$9 3.97,21.22 v4.75,22 | U$1.PAD$7 2.29,21.79 v2.75,22.25 | SJ2.1 83.86,1.61 v83.5,1.25 | U$3.P$4 74.62,10.12 v76.25,11.75 74.95,13.05 U$3.P$5 | J2.3 85.98,44.27 v86.5,43.75 87.25,44.5 J2.5 | J14.3 92.73,33.02 v92.75,33 | BAT1.GND v87.25,17 | J25.5 11.41,29.91 v10.75,29.25
  Bottom 0.406: U$1.PAD$10 3.96,14.79 v4.25,14.5 | U$3.P$3 80.75,14.63 v80.75,16 | J2.9 89.75,44.91 v89.75,43.75
  pour GND: 96.52,50.8 96.52,0 0,0 0,50.8
LCD_A0
  Top 0.305: U1.62 31.64,5.5 49.25,5.5 50.75,7 50.75,11 49.75,12 X1.8
LCD_BL
  Top 0.305: U1.58 30.31,4 50,4 52.25,6.25 52.25,9.75 52.75,10.25 54,10.25 55,11.25 55,12 56,12 56.65,12.65 R19.2
LCD_CS
  Top 0.305: U1.59 30.52,4.5 49.75,4.5 51.75,6.5 X1.10
LCD_RST
  Top 0.305: U1.61 31.43,5 49.5,5 51.25,6.75 51.25,11.25 50.75,11.75 X1.9
MISO1  (via drill 1.27)
  Top 0.305: U1.22 21.27,13.75 20.75,13.75 20,14.5 20,15.5 20.5,16 20.5,17.75 20.32,17.93 J10.1
  Top 1.905: J10.1 v20.32,20.32
  Bottom 1.905: J10.1 v20.32,20.32
MOSI1  (via drill 1.27)
  Top 0.305: U1.23 21.06,13.25 20.5,13.25 19.5,14.25 19.5,16.75 17.84,18.41 J13.1
  Top 1.905: J13.1 v17.78,20.32
  Bottom 1.905: J13.1 v17.78,20.32
MOSI3  (via drill 0.2)
  Top 0.305: U1.57 30.1,3.5 50.25,3.5 52.75,6 52.75,8.25 v53,8.5 | X1.6 47.75,10 v49.25,8.5
  Bottom 0.305: v49.25,8.5 v53,8.5
N$1
  Top 0.305: U4.4 11.8,15.2 12,15 12,14.35 C4.1
N$4
  Top 0.305: X1.11 52.75,11 53,10.75 53.75,10.75 54.5,11.5 54.5,12.5 55,13 R19.1
N$5  (via drill 0.2)
  Top 0.305: R18.2 v85.75,39
  Bottom 0.305: J2.4 85.98,39.23 v85.75,39
N$7
  Top 0.305: LED1.C R3.2
N$11
  Top 0.305: LED2.C R22.2
N$12  (via drill 0.2)
  Top 0.2: 86.75,38.15 R23.2
  Top 0.305: 86.75,38.15 v86.75,39
  Bottom 0.305: J2.6 87.25,39.5 v86.75,39
N$13  (via drill 0.2)
  Top 0.305: R20.2 83.25,39.25 v83.75,39.75
  Bottom 0.305: J2.2 84.09,40.09 v83.75,39.75
N$14
  Top 1.27: J$1.GND@3 J26.1
  Bottom 1.27: J$1.GND@3 J26.1
N$15
  Top 1.27: J$1.GND@0 J23.1
  Bottom 1.27: J$1.GND@0 J23.1
N$16  (via drill 0.2)
  Top 0.305: R25.1 79.65,15.4 78.75,14.5 78.75,9.75 v78.25,9.25
  Bottom 0.305: v78.25,9.25 79.87,9.25 U$3.P$1
N$20
  Top 1.27: J$1.SIG J27.1
N$37
  Top 0.3: 44.76,13.74 X1.3
  Top 0.305: 44.76,13.74 44.5,14 C35.1
N$38
  Top 0.305: X1.2 43.75,11.75 41.75,11.75 41.5,12 38.5,12 38,12.5 38,13.25 38.75,14 C35.2
N$39
  Top 0.305: C36.2 41.12,12.78 X1.1
NRST  (via drill 0.2)
  Top 0.305: U1.7 29,11.19 29,10.25 27.25,8.5 v27.25,7 | C3.1 87.75,34.6 | v87.75,35.75 87.75,34.6 | 87.75,34.6 88.9,34.6 89.25,34.25 v89.25,31.75 88.5,31 84,31 83.25,30.25 83.25,11 77.75,5.5 75,5.5 73.75,4.25 v73.25,4.25
  Bottom 0.305: J2.10 89.79,38.79 87.75,36.75 v87.75,35.75 | v89.25,31.75 89.25,31.38 J14.5 | v73.25,4.25 72,5.5 61.25,5.5 60.75,5 29.25,5 v27.25,7
OSC_IN
  Top 0.305: U1.5 31.23,12 33.38,12 U$7.3
PA1  (via drill 1.27)
  Top 0.305: U1.15 28.15,16 29.25,16 29.75,16.5 31.5,16.5 32,17 33.75,17 35.16,18.41 J19.1
  Top 1.905: J19.1 v35.56,20.32
  Bottom 1.905: v35.56,20.32 J19.1
PA2  (via drill 1.27)
  Top 0.305: U1.16 27.95,16.5 29,16.5 29.5,17 31.25,17 32.66,18.41 J3.1
  Top 1.905: J3.1 v33.02,20.32
  Bottom 1.905: J3.1 v33.02,20.32
PA3  (via drill 1.27)
  Top 0.305: U1.17 23.8,14.75 25.5,14.75 27.75,17 28.75,17 30.16,18.41 J12.1
  Top 1.905: J12.1 v30.48,20.32
  Bottom 1.905: J12.1 v30.48,20.32
PA4  (via drill 0.2, 1.27)
  Top 0.305: U1.20 21.43,15 v21.25,15
  Top 1.905: J5.1 v25.4,20.32
  Bottom 0.305: v21.25,15 22,14.25 23.5,14.25 25.4,16.15 J5.1
  Bottom 1.905: J5.1 v25.4,20.32
PA8  (via drill 0.2)
  Top 0.305: U1.41 20.1,3 17.25,3 v16.75,3.5 | v13.5,2.25 8.25,2.25 8.25,2.87 LED2.A
  Bottom 0.305: v16.75,3.5 14.75,3.5 v13.5,2.25
PB0  (via drill 0.2, 1.27)
  Top 0.305: U1.26 19.69,12.5 v19.25,12.5
  Top 1.905: J6.1 v27.94,20.32
  Bottom 0.305: v19.25,12.5 20,11.75 21.75,11.75 27.94,17.94 J6.1
  Bottom 1.905: J6.1 v27.94,20.32
PB1  (via drill 0.2, 1.27)
  Top 0.305: U1.27 21.73,9.75 v22.25,9.75
  Top 1.905: J11.1 v40.64,20.32
  Bottom 0.305: v22.25,9.75 22.25,10 28.75,16.5 36.5,16.5 37,17 38.75,17 40.16,18.41 J11.1
  Bottom 1.905: J11.1 v40.64,20.32
PB10  (via drill 0.2, 1.27)
  Top 0.305: U1.29 21,9.07 v21,8.5
  Top 1.905: J24.1 v38.1,20.32
  Bottom 0.305: v21,8.5 21,9.5 28.5,17 36.25,17 37.66,18.41 J24.1
  Bottom 1.905: J24.1 v38.1,20.32
PC0  (via drill 0.2, 1.27)
  Top 0.305: U1.8 28.1,11 27.5,11 v27,10.5
  Top 1.905: J20.1 v50.8,20.32
  Bottom 0.305: v27,10.5 27.25,10.25 28.25,10.25 29.5,11.5 31.75,11.5 34.75,14.5 37.5,14.5 38,15 39.75,15 40.25,15.5 42,15.5 42.5,16 44.25,16 44.75,16.5 46.5,16.5 47,17 49,17 50.41,18.41 J20.1
  Bottom 1.905: J20.1 v50.8,20.32
PC1  (via drill 0.2, 1.27)
  Top 0.305: U1.9 27.9,11.5 27,11.5 v26,10.5
  Top 1.905: v48.26,20.32 J22.1
  Bottom 0.305: v26,10.5 26.75,11.25 27.25,11.25 27.75,10.75 28,10.75 29.25,12 31.5,12 34.5,15 37.25,15 37.75,15.5 39.5,15.5 40,16 41.75,16 42.25,16.5 44,16.5 44.5,17 46.25,17 47.66,18.41 J22.1
  Bottom 1.905: v48.26,20.32 J22.1
PC2  (via drill 0.2, 1.27)
  Top 0.305: U1.10 27.69,12 26.5,12 v26,11.5
  Top 1.905: J33.1 v45.72,20.32
  Bottom 0.305: v26,11.5 26.75,12.25 26.75,13 29.25,15.5 37,15.5 37.5,16 39.25,16 39.75,16.5 41.5,16.5 42,17 43.75,17 45.16,18.41 J33.1
  Bottom 1.905: J33.1 v45.72,20.32
PC3  (via drill 0.2, 1.27)
  Top 0.305: U1.11 27.5,12.52 27.5,12.5 v26,12.5
  Top 1.905: J7.1 v43.18,20.32
  Bottom 0.305: v26,12.5 26,13 29,16 36.75,16 37.25,16.5 39,16.5 39.5,17 41.25,17 42.66,18.41 J7.1
  Bottom 1.905: J7.1 v43.18,20.32
PC4  (via drill 0.2, 1.27)
  Top 0.305: U1.24 23.85,9.75 v24,9.75
  Top 1.905: J8.1 v53.34,20.32
  Bottom 0.305: v24,9.75 28.5,9.75 29.75,11 32,11 35,14 37.75,14 38.25,14.5 40,14.5 40.5,15 42.25,15 42.75,15.5 44.5,15.5 45,16 46.75,16 47.25,16.5 49.25,16.5 49.75,17 51.5,17 52.91,18.41 J8.1
  Bottom 1.905: J8.1 v53.34,20.32
PC13  (via drill 0.2, 1.27)
  Top 0.305: U1.2 31.85,10.5 32.25,10.5 32.75,10 v33,10
  Top 1.905: J21.1 v55.88,20.32
  Bottom 0.305: v33,10 33,11.25 35.25,13.5 38,13.5 38.5,14 40.25,14 40.75,14.5 42.5,14.5 43,15 44.75,15 45.25,15.5 47,15.5 47.5,16 49.5,16 50,16.5 51.75,16.5 52.25,17 54,17 55.41,18.41 J21.1
  Bottom 1.905: J21.1 v55.88,20.32
RTC1
  Top 0.305: C9.1 33.35,7.5 34,7.5 Y3.P$2 34.5,7.75 35.25,8.5 35.25,10.25 34.75,10.75 32.75,10.75 32.5,11 31.64,11 U1.3
RTC2
  Top 0.305: U1.4 31.43,11.5 32.75,11.5 33,11.25 35,11.25 35.75,10.5 35.75,8.5 37,7.25 Y3.P$1 37.6,6.4 C6.1
RTC_BAT  (via drill 0.2)
  Top 0.305: v28.25,7 28.75,7.5 31,7.5 32,8.5 32,9.31 U1.1
  Bottom 0.305: BAT1.PWR@1 89.38,9.75 86.75,9.75 86.25,10.25 78,10.25 73.75,6 61,6 60.5,5.5 29.5,5.5 28.25,6.75 v28.25,7
SCK3  (via drill 0.2)
  Top 0.305: U1.55 29.19,3 50.5,3 53.75,6.25 53.75,8.75 v53,9.5 | X1.7 48.5,12.52 48.5,10.25 49.5,9.25 v50,9.25
  Bottom 0.305: v50,9.25 52.75,9.25 v53,9.5
SCLK1  (via drill 1.27)
  Top 0.305: U1.21 21.48,14.25 21,14.25 20.5,14.75 20.5,15.25 21,15.75 21,17.25 22.16,18.41 J4.1
  Top 1.905: J4.1 v22.86,20.32
  Bottom 1.905: J4.1 v22.86,20.32
SD_DETECT  (via drill 0.2)
  Top 0.305: U1.35 18.5,5.64 18.5,5.25 19.75,4 v19.75,3.75 | J1.9 66.64,13.64 66.5,13.5 66.5,12.5 64.75,10.75 v64.75,10.25
  Bottom 0.305: v19.75,3.75 20.25,3.75 25.25,8.75 29,8.75 31.25,6.5 60,6.5 60.5,7 61.25,7 64.5,10.25 v64.75,10.25
SDIO_CLK  (via drill 0.2)
  Top 0.305: U1.53 28.77,2 60.25,2 60.25,10.25 v61.5,10.25 R7.2 | v71,12.75 71,13.95 J1.5
  Bottom 0.305: v61.5,10.25 61.75,10.25 62.5,11 63,11 64,12 71,12 v71,12.75
SDIO_CMD  (via drill 0.2)
  Top 0.305: U1.54 28.98,2.5 59.75,2.5 59.75,11.5 v61.5,11.5 R14.2 | v73.25,12.75 J1.3
  Bottom 0.305: v61.5,11.5 62.75,11.5 64.75,13.5 72.5,13.5 v73.25,12.75
SDIO_D0  (via drill 0.2)
  Top 0.305: U1.39 21.19,5.5 22.25,5.5 23.25,4.5 v23.5,4.5 | v64,2.25 64,4.5 | R13.2 64,4.5 | 64,4.5 64.75,5.25 64.75,6.25 66.25,7.75 66.25,10.75 68.84,13.34 J1.7 68.75,13.9
  Bottom 0.305: v64,2.25 63.75,2.5 62.75,2.5 62.25,2 27.5,2 26.25,3.25 26,3.25 25,4.25 24.5,4.25 24.25,4.5 v23.5,4.5
SDIO_D1  (via drill 0.2)
  Top 0.305: U1.40 21.4,5 22,5 v23.5,3.5 | v63.25,1.75 63.25,5.25 63.75,5.75 R17.2 63.9,6.1 65.75,7.95 65.75,11 67.75,13 J1.8 67.5,13.75
  Bottom 0.305: v63.25,1.75 63,1.5 27.25,1.5 26,2.75 25.75,2.75 24.75,3.75 23.75,3.75 v23.5,3.5
SDIO_D2  (via drill 0.2)
  Top 0.305: U1.51 28.36,1 61.25,1 61.25,7.75 61.5,7.75 | J1.1 75.25,13.8 75.25,13 73.5,11.25 v73.25,11.25 | 61.5,7.75 R5.2 | v61.5,8.25 61.5,7.75
  Bottom 0.305: v61.5,8.25 63.25,10 63.5,10 64.5,11 73,11 v73.25,11.25
SDIO_D3  (via drill 0.2)
  Top 0.305: U1.52 28.57,1.5 60.75,1.5 60.75,9 61.5,9 | J1.2 74.25,13.9 74.25,12.75 73.5,12 72.5,12 v72.25,11.75 | 61.5,9 R6.2 | v61.5,9.25 61.5,9
  Bottom 0.305: v61.5,9.25 62.75,10.5 63.25,10.5 64.25,11.5 72,11.5 v72.25,11.75
SW_A  (via drill 0.2)
  Top 0.2: S3.3 90.78,37.97 91.75,37 91.75,36.25 R8.2
  Top 0.305: U1.36 20.57,7 25,7 v25.5,6.5 | v73.75,2.75 73.75,3.5 75.25,5 78,5 83.75,10.75 83.75,30 84.25,30.5 89.25,30.5 91.75,33 91.75,36.14 R8.2
  Bottom 0.305: v73.75,2.75 73.5,2.5 70,2.5 68.5,4 62,4 61.5,3.5 28.5,3.5 27.25,4.75 26.75,4.75 26,5.5 26,6 v25.5,6.5
SW_B  (via drill 0.2)
  Top 0.305: U1.37 20.77,6.5 24.25,6.5 v25.25,5.5 | v74.5,2.25 74.5,3.5 75.5,4.5 78.25,4.5 86.25,12.5 86.25,20.25 89.5,23.5 S2.3 R11.2
  Bottom 0.305: v74.5,2.25 74.25,2 66,2 64.5,3.5 62.25,3.5 61.75,3 28.25,3 27,4.25 26.5,4.25 v25.25,5.5
SW_C  (via drill 0.2)
  Top 0.305: R12.2 91.81,10.91 S1.3 89.27,9.02 89.25,9 83.5,9 78.5,4 75.75,4 75.25,3.5 v75.25,1.75 | U1.38 20.98,6 23.25,6 24,5.25 v24.25,5.25
  Bottom 0.305: v75.25,1.75 75,1.5 65.75,1.5 64.25,3 62.5,3 62,2.5 28,2.5 26.75,3.75 26.25,3.75 25.25,4.75 25,4.75 24.5,5.25 v24.25,5.25
SW_D  (via drill 0.2)
  Top 0.305: S4.3 1.55,38 3.25,38 4.1,37.15 R15.2 4.1,33.65 v8.75,29 | v11,9.5 11.5,9 13.5,9 13.75,9 15.75,7 16.5,7 17.25,6.25 17.7,6.25 U1.33
  Bottom 0.305: v8.75,29 8.75,11.25 10.5,9.5 v11,9.5
SW_E  (via drill 0.2)
  Top 0.305: S5.3 6.6,27.15 v7.75,26 | v10.5,8.5 13.5,8.5 15.5,6.5 16.25,6.5 17,5.75 17.9,5.75 U1.34
  Top 0.406: R16.2 4.65,29.26 S5.3
  Bottom 0.305: v7.75,26 8.25,25.5 8.25,10.75 v10.5,8.5
SW_PWR  (via drill 0.2)
  Top 0.305: U1.14 26.11,13.25 25.75,13.25 25.25,12.75 v25.25,12 | S6.1 1.52,12.08 R1.1 v6.35,6.15
  Bottom 0.305: v25.25,12 25,12 23.25,10.25 23.25,9.75 18.5,5 7,5 6.35,5.65 v6.35,6.15
SWDCLK  (via drill 0.2)
  Top 0.305: U1.49 25.45,2.5 v25,2.5 | R2.1 85,36.6 | 85,36.6 R18.1 | 85,36.6 v85,34.25 85,33.5 82.25,30.75 82.25,11.5 78.25,7.5 77.25,7.5 v77,7.75
  Bottom 0.305: J14.2 85.11,34.36 v85,34.25 | v77,7.75 77,2 76,1 27,1 26.25,1.75 25.75,1.75 v25,2.5
SWDIO  (via drill 0.2)
  Top 0.305: U1.46 21.75,1.11 v21.75,0.75 | R4.1 82.75,36.6 | 82.75,36.6 R20.1 | 82.75,36.6 82.75,34.75 83.25,34.25 v83.5,34.25 81.75,32 81.75,11.75 78.25,8.25 v78,8.25
  Bottom 0.305: v83.5,34.25 84.73,33.02 J14.4 84.77,33.02 | v78,8.25 77.75,8 77.75,5.5 77.5,5.25 77.5,1.75 76.25,0.5 24,0.5 22.75,1.75 22.39,1.75 21.75,1.11 v21.75,0.75
SWO  (via drill 0.2)
  Top 0.305: U1.50 28.15,0.5 69,0.5 69.25,0.75 69.25,1.75 73,5.5 74,5.5 74.5,6 77.5,6 82.75,11.25 82.75,30.5 84,31.75 v86,31.75 86,35.5 87,36.5 R23.1 R24.1
  Bottom 0.305: v86,31.75 86,31.37 J14.6
USART1_RX  (via drill 0.2)
  Top 0.305: U1.43 20.02,1.5 17,1.5 14.75,3.75 v14.75,5.75
  Bottom 0.305: J25.2 6.94,35.56 8.75,33.75 8.75,32 9.25,31.5 13.25,31.5 13.5,31.25 13.5,23.25 14,22.75 14,8 14.75,7.25 v14.75,5.75
USART1_TX  (via drill 0.2)
  Top 0.305: U1.42 19.81,2 17.25,2 15.5,3.75 15.5,5.5 v15.75,5.75 | v7.5,31.75 8.5,31.75 9,32.25 9,34 9.25,34.25 v12.75,34.25
  Bottom 0.305: J25.4 6.37,32.88 v7.5,31.75 | v12.75,34.25 13.75,34.25 14,34 14,23.5 14.5,23 14.5,8.25 15.25,7.5 15.25,6.25 v15.75,5.75
USB+
  Top 0.305: U1.45 20.43,0.5 16.5,0.5 8.75,8.25 8.75,16.5 R9.2
USB-
  Top 0.305: U1.44 20.23,1 16.75,1 9.25,8.5 9.25,17.5 8.75,18 R10.2
VBAT2  (via drill 0.2)
  Top 0.305: U1.25 24.9,8 v26.5,8 | v77.25,14.75 77.25,15.9 R26.1 R25.2
  Bottom 0.305: v26.5,8 29,8 31,6 60.25,6 60.75,6.5 73.5,6.5 77.25,10.25 v77.25,14.75
VBUS
  Top 0.305: U1.30 18.36,11 17.25,11 14.75,13.5 14.75,18 14.7,18.05 U4.1
  Top 0.406: D2.C 10.4,18.73 D3.C | 9.75,18.25 9.75,19.25 10,19.5 | 10.25,21.25 10.25,19.75 | 10.25,19.75 10.25,19.5 | 10.25,19 10.25,18.5 10.25,18.25 10.5,18.25 10.5,21.5 | 10.25,19.75 10,19.5 | 10,19.5 10,18.5
  Top 0.61: D3.C 10.28,18.05 U4.3 11.75,18.1 11.75,18.5 | U4.1 13.7,18.8 13.25,19.25 | 13.25,19.25 12,19.25 11.75,19 | 10.25,18.5 11.75,18.5 | 11.75,18.5 11.75,19 | 11.75,19 10.25,19 10.25,19.5 12,19.5 | 12,19.5 13,19.5 | 13,19.5 13.25,19.25 | C1.1 12,19.5 | C2.1 13.25,19.75 13,19.5
VBUS_IN
  Top 0.305: 4.69,19.59 4.69,19.94 5.25,20.5
  Top 0.406: U$1.PIN$1 4.69,19.59 D2.A | 6,21.25 5.25,20.5 4.5,19.75 3.5,19.75

### Text on the board
bPlace: Pax Instruments | Armwiz / v0.1
Measures: MOSI1 | MISO1 | SCLK1 | PA4 | PB0 | PA3 | PA2 | PA1 | PB10 | PB1 | PC3 | PC2 | PC1 | PC0 | PC4 | PC13